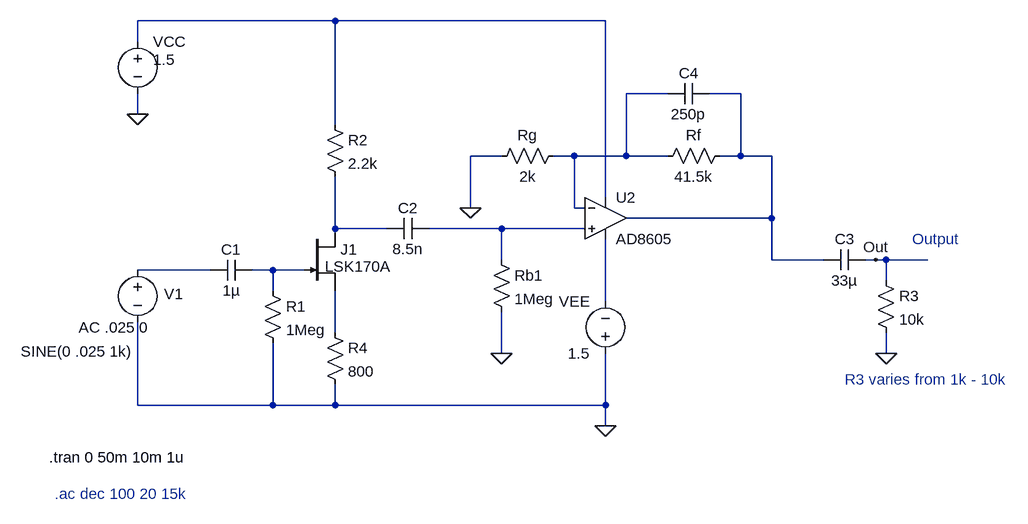
[diagram p0: schematic microphone_12_RMS.asc]
microphone_12_RMS.asc, the LTspice schematic file:
Version 4
SHEET 1 1496 680
WIRE -256 -128 -560 -128
WIRE 160 -128 -256 -128
WIRE -560 -96 -560 -128
WIRE 256 -16 192 -16
WIRE 368 -16 320 -16
WIRE -560 16 -560 -16
WIRE -256 32 -256 -128
WIRE 0 80 -48 80
WIRE 112 80 80 80
WIRE 192 80 192 -16
WIRE 192 80 112 80
WIRE 256 80 192 80
WIRE 368 80 368 -16
WIRE 368 80 336 80
WIRE 416 80 368 80
WIRE 160 144 160 -128
WIRE -48 160 -48 80
WIRE 112 160 112 80
WIRE 128 160 112 160
WIRE 416 176 416 80
WIRE 416 176 192 176
WIRE -256 192 -256 112
WIRE -176 192 -256 192
WIRE 0 192 -112 192
WIRE 128 192 0 192
WIRE 0 240 0 192
WIRE 416 240 416 176
WIRE 496 240 416 240
WIRE 576 240 560 240
WIRE 592 240 576 240
WIRE 656 240 592 240
WIRE -448 256 -560 256
WIRE -352 256 -384 256
WIRE -304 256 -352 256
WIRE 592 272 592 240
WIRE -352 288 -352 256
WIRE 160 304 160 208
WIRE -256 352 -256 288
WIRE 0 384 0 320
WIRE 592 384 592 352
WIRE -560 464 -560 336
WIRE -352 464 -352 368
WIRE -352 464 -560 464
WIRE -256 464 -256 432
WIRE -256 464 -352 464
WIRE 160 464 160 384
WIRE 160 464 -256 464
WIRE 160 496 160 464
FLAG 592 384 0
FLAG -560 16 0
FLAG 0 384 0
FLAG -48 160 0
FLAG 576 240 Out
FLAG 160 496 0
SYMBOL voltage -560 240 R0
WINDOW 3 -180 141 Left 2
WINDOW 123 -91 104 Left 2
WINDOW 39 0 0 Left 0
WINDOW 0 41 53 Left 2
SYMATTR Value SINE(0 .025 1k)
SYMATTR Value2 AC .025 0
SYMATTR InstName V1
SYMBOL res -272 16 R0
SYMATTR InstName R2
SYMATTR Value 2.2k
SYMBOL njf -304 192 R0
WINDOW 3 32 58 Left 2
SYMATTR Value LSK170A
SYMATTR InstName J1
SYMBOL cap -384 240 R90
WINDOW 0 0 32 VBottom 2
WINDOW 3 32 32 VTop 2
SYMATTR InstName C1
SYMATTR Value 1µ
SYMBOL res -368 272 R0
SYMATTR InstName R1
SYMATTR Value 1Meg
SYMBOL cap -112 176 R90
WINDOW 0 0 32 VBottom 2
WINDOW 3 32 32 VTop 2
SYMATTR InstName C2
SYMATTR Value 8.5n
SYMBOL res 576 256 R0
SYMATTR InstName R3
SYMATTR Value 10k
SYMBOL cap 560 224 R90
WINDOW 0 0 32 VBottom 2
WINDOW 3 32 32 VTop 2
SYMATTR InstName C3
SYMATTR Value 33µ
SYMBOL res -272 336 R0
SYMATTR InstName R4
SYMATTR Value 800
SYMBOL voltage -560 -112 R0
WINDOW 3 24 44 Left 2
WINDOW 123 0 0 Left 0
WINDOW 39 0 0 Left 0
SYMATTR Value 1.5
SYMATTR InstName VCC
SYMBOL res 352 64 R90
WINDOW 0 0 56 VBottom 2
WINDOW 3 32 56 VTop 2
SYMATTR InstName Rf
SYMATTR Value 41.5k
SYMBOL res 96 64 R90
WINDOW 0 0 56 VBottom 2
WINDOW 3 32 56 VTop 2
SYMATTR InstName Rg
SYMATTR Value 2k
SYMBOL voltage 160 400 R180
WINDOW 0 24 96 Left 2
WINDOW 3 24 16 Left 2
WINDOW 123 0 0 Left 0
WINDOW 39 0 0 Left 0
SYMATTR InstName VEE
SYMATTR Value 1.5
SYMBOL res -16 224 R0
SYMATTR InstName Rb1
SYMATTR Value 1Meg
SYMBOL OpAmps\\AD8605 160 112 R0
SYMATTR InstName U2
SYMBOL cap 320 -32 R90
WINDOW 0 0 32 VBottom 2
WINDOW 3 32 32 VTop 2
SYMATTR InstName C4
SYMATTR Value 250p
TEXT 632 208 Left 2 ;Output
TEXT 528 424 Left 2 ;R3 varies from 1k - 10k
TEXT -696 544 Left 2 !.tran 0 50m 10m 1u
TEXT -688 600 Left 2 ;.ac dec 100 20 15k

The netlist it stands for:
* microphone_12_RMS.asc
V1 N006 0 SINE(0 .025 1k) AC .025 0
R2 N001 N004 2.2k
J1 N004 N007 N009 LSK170A
C1 N007 N006 1µ
R1 N007 0 1Meg
C2 N005 N004 8.5n
R3 Out 0 10k
C3 Out N003 33µ
R4 N009 0 800
VCC N001 0 1.5
Rf N003 N002 41.5k
Rg N002 0 2k
VEE 0 N008 1.5
Rb1 N005 0 1Meg
XU2 N005 N002 N001 N008 N003 AD8605  ; pins In+ In- V+ V- OUT
C4 N003 N002 250p
.model NJF NJF
.model PJF PJF
.lib standard.jft
* Output
* R3 varies from 1k - 10k
.tran 0 50m 10m 1u
* .ac dec 100 20 15k
.lib ADI.lib
.backanno
.end